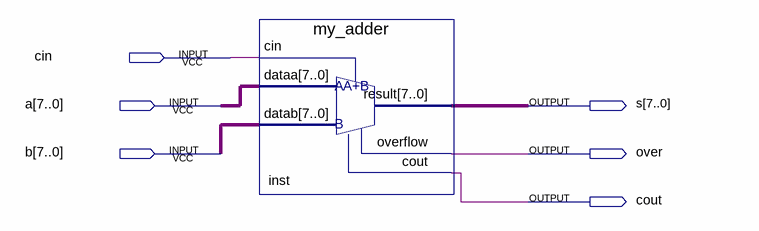
[diagram p0: schematic sheet]
// Quartus schematic adder_mod.bdf as structural Verilog: 1 symbols, 6 pins
module adder_mod (
  input  cin,
  input  [7:0] a,
  input  [7:0] b,
  output [7:0] s,
  output over,
  output cout
);

  my_adder inst (.cin(cin), .dataa(a), .datab(b), .result(s), .overflow(over), .cout(cout));
endmodule
